# Altium schematic sheet [03] PWM DRIVER.SchDoc
size A
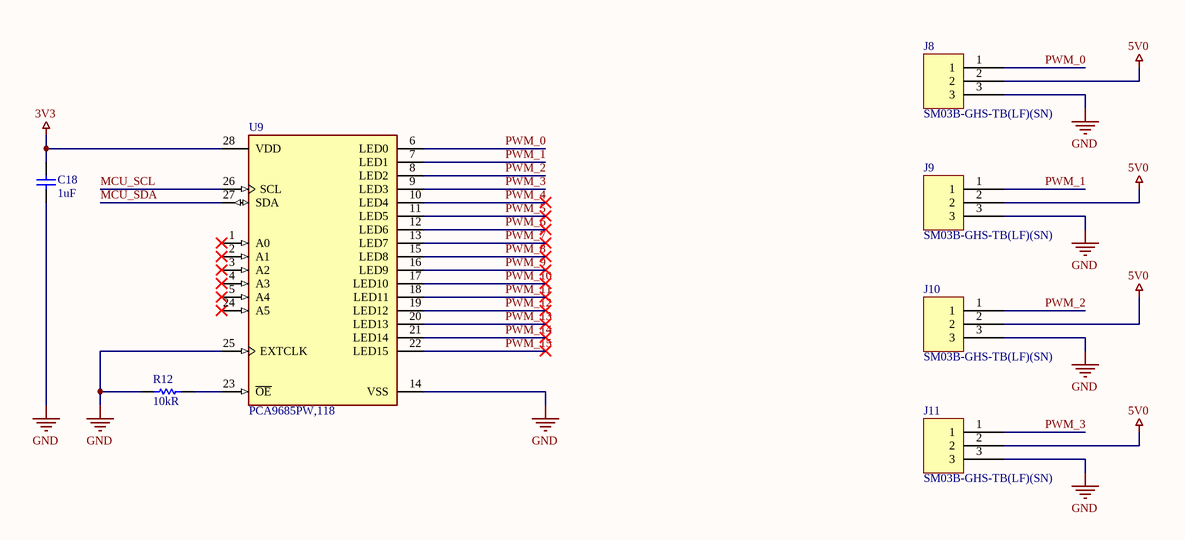
[diagram p0: [03] PWM DRIVER.SchDoc]

## Parts
C18  1uF  [INCH 0805 - METRIC 2012 - H140]
J8  SM03B-GHS-TB(LF)(SN)  [SM03B-GHS-TB(LF)(SN)]
J9  SM03B-GHS-TB(LF)(SN)  [SM03B-GHS-TB(LF)(SN)]
J10  SM03B-GHS-TB(LF)(SN)  [SM03B-GHS-TB(LF)(SN)]
J11  SM03B-GHS-TB(LF)(SN)  [SM03B-GHS-TB(LF)(SN)]
R12  10kR  [INCH 0805 - METRIC 2012 - H070]
U9  PCA9685PW,118  [FP-SOT361-1-MFG]

## Nets
3V3: C18.2 U9.28(VDD)
5V0: J8.2 J9.2 J10.2 J11.2
GND: C18.1 J8.3 J9.3 J10.3 J11.3 R12.2 U9.14(VSS) U9.25(EXTCLK)
MCU_SCL: U9.26(SCL)
MCU_SDA: U9.27(SDA)
PWM_0: J8.1 U9.6(LED0)
PWM_1: J9.1 U9.7(LED1)
PWM_2: J10.1 U9.8(LED2)
PWM_3: J11.1 U9.9(LED3)
PWM_4: U9.10(LED4)
PWM_5: U9.11(LED5)
PWM_6: U9.12(LED6)
PWM_7: U9.13(LED7)
PWM_8: U9.15(LED8)
PWM_9: U9.16(LED9)
PWM_10: U9.17(LED10)
PWM_11: U9.18(LED11)
PWM_12: U9.19(LED12)
PWM_13: U9.20(LED13)
PWM_14: U9.21(LED14)
PWM_15: U9.22(LED15)
NetR12_1: R12.1 U9.23(~{OE})

Not connected (* = marked no-connect by the designer): U9 1(A0)* 2(A1)* 3(A2)* 4(A3)* 5(A4)* 24(A5)*

## Library data of the parts
C18 = GCM21BR71E105KA56L: CAP SMD 1uF 25V 10% 0805; Manufacturer: Murata; Dielectric: X7R; Supplier 1: Digi-Key; Manufacturer Part Number: GCM21BR71E105KA56L; RoHS: Yes; Category: Ceramic Capacitors; Stock 1: 1572955; Pricing 1: 1=0.33000, 10=0.22500, 100=0.12760, 500=0.09004, 1000=0.07878 (USD); Mount: Surface Mount; Case/Package: 0805; Case Code (Metric): 2012; Case Code (Imperial): 0805; Min Operating Temperature: -55°C; Max Operating Temperature: 125°C; Termination: SMD/SMT; Voltage: 25V; Package Quantity: 3000; Capacitance: 1uF; Voltage Rating: 25V; Tolerance: 10%; Packaging: Tape and Reel; Voltage Rating (DC): 25V; Length: 2mm; Height: 1.25mm; Thickness: 0.055inch; Depth: 1.25mm; Width: 0.049inch; Ratings: AEC-Q200; Radiation Hardening: No; REACH SVHC: No SVHC; Lead Free: Lead Free; ComponentLink1URL: https://datasheet.ciiva.com/3778/359gcm21br71e105ka5623-3778560.pdf?src-supplier=Arrow; ComponentLink1Description: https://datasheet.ciiva.com/3778/359gcm21br71e105ka5623-3778560.pdf?src-supplier=Arrow; ComponentLink2URL: https://datasheet.ciiva.com/16624/product-16624576.pdf?src-supplier=Avnet+Europe; ComponentLink2Description: https://datasheet.ciiva.com/16624/product-16624576.pdf?src-supplier=Avnet+Europe; ComponentLink3URL: https://datasheet.ciiva.com/18183/getdatasheetpartid-153106-18183696.pdf?src-supplier=Verical; ComponentLink3Description: https://datasheet.ciiva.com/18183/getdatasheetpartid-153106-18183696.pdf?src-supplier=Verical; ComponentLink4URL: https://datasheet.ciiva.com/11789/0900766b80ef92d0-11789092.pdf?src-supplier=RSComponents; ComponentLink4Description: https://datasheet.ciiva.com/11789/0900766b80ef92d0-11789092.pdf?src-supplier=RSComponents; ComponentLink5URL: https://datasheet.ciiva.com/137/product-137199.pdf?src-supplier=Digi-Key; ComponentLink5Description: https://datasheet.ciiva.com/137/product-137199.pdf?src-supplier=Digi-Key; ComponentLink6URL: https://datasheet.ciiva.com/137/product-137200.pdf?src-supplier=Digi-Key; ComponentLink6Description: https://datasheet.ciiva.com/137/product-137200.pdf?src-supplier=Digi-Key; ComponentLink7URL: https://datasheet.ciiva.com/137/product-137201.pdf?src-supplier=Digi-Key; ComponentLink7Description: https://datasheet.ciiva.com/137/product-137201.pdf?src-supplier=Digi-Key; ComponentLink8URL: https://datasheet.ciiva.com/2989/product-2989245.pdf?src-supplier=Avnet; ComponentLink8Description: https://datasheet.ciiva.com/2989/product-2989245.pdf?src-supplier=Avnet; ComponentLink9URL: https://datasheet.ciiva.com/2989/product-2989246.pdf?src-supplier=Avnet; ComponentLink9Description: https://datasheet.ciiva.com/2989/product-2989246.pdf?src-supplier=Avnet; Supplier Part Number 1: 490-4785-1-ND
J8-J11 = SM03B-GHS-TB(LF)(SN): JST (JAPAN SOLDERLESS TERMINALS) - SM03B-GHS-TB (LF)(SN) - MACHO, 1,25 MM, 3 VÍAS, SMT, 90 GRADOS; Current Rating: 1A; Voltage Rating (AC): 50V; Gender: Male; Connector Type: Outer Shroud Contact; Number of Positions: 3; Wire/Cable Gauge: 26AWG; Pitch: 0.049inch; Supplier 1: Digi-Key; Manufacturer: JST; Manufacturer Part Number: SM03B-GHS-TB(LF)(SN); RoHS: Yes; Category: Headers and Wire Housings; Stock 1: 8954; Pricing 1: 1=0.49000, 10=0.46500, 100=0.32580, 500=0.27924, 1000=0.23270 (USD); Mount: Surface Mount; Contact Plating: Tin; Contact Material: Bronze; Housing Material: Nylon; Color: Natural; Housing Color: Natural; Min Operating Temperature: -25°C; Max Operating Temperature: 85°C; Number of Rows: 1; Voltage Rating: 50V; Orientation: Right Angle; Packaging: Tape and Reel; Termination: Solder; Fastening Type: Ramp; Number of Contacts: 3; REACH SVHC: No SVHC; Lead Free: Lead Free; ComponentLink1URL: https://datasheet.ciiva.com/25617/0900766b810cef18-25617270.pdf?src-supplier=RSComponents; ComponentLink1Description: https://datasheet.ciiva.com/25617/0900766b810cef18-25617270.pdf?src-supplier=RSComponents; ComponentLink2URL: https://datasheet.ciiva.com/16379/jstsm03b-ghs-tb-lf-sn-16379590.pdf?src-supplier=Future+Electronics; ComponentLink2Description: https://datasheet.ciiva.com/16379/jstsm03b-ghs-tb-lf-sn-16379590.pdf?src-supplier=Future+Electronics; ComponentLink3URL: https://datasheet.ciiva.com/8052/5438-8052261.pdf?src-supplier=Element14; ComponentLink3Description: https://datasheet.ciiva.com/8052/5438-8052261.pdf?src-supplier=Element14; Supplier Part Number 1: 455-1565-1-ND
R12 = ERJ-P06F1002V: RES SMD 10kOHM 1% 1/2W 0805; Manufacturer: Panasonic; Power Rating: 500mW; Voltage Rating: 150V; Temperature Coefficient: 100ppm/°C; Supplier 1: Digi-Key; Manufacturer Part Number: ERJ-P06F1002V; RoHS: Yes; Category: Chip SMD Resistors; Stock 1: 119213; Pricing 1: 1=0.17000, 10=0.14800, 100=0.05770, 1000=0.02416, 2500=0.02214 (USD); Mount: Surface Mount; Case/Package: 0805; Case Code (Imperial): 0805; Case Code (Metric): 2012; Contact Plating: Tin; Min Operating Temperature: -55°C; Max Operating Temperature: 155°C; Resistance: 10kR; Packaging: Tape and Reel; Tolerance: 1%; Package Quantity: 5000; Termination: SMD/SMT; Military Standard: Not; Voltage Rating (DC): 150V; Composition: Thick Film; Length: 2mm; Height: 0.6mm; Width: 1.2mm; Depth: 1.25mm; Radiation Hardening: No; REACH SVHC: No SVHC; Lead Free: Lead Free; ComponentLink1URL: https://datasheet.ciiva.com/11811/0900766b812cb812-11811124.pdf?src-supplier=RSComponents; ComponentLink1Description: https://datasheet.ciiva.com/11811/0900766b812cb812-11811124.pdf?src-supplier=RSComponents; ComponentLink2URL: https://datasheet.ciiva.com/24069/aoa0000ce4-64075-24069191.pdf?src-supplier=Mouser; ComponentLink2Description: https://datasheet.ciiva.com/24069/aoa0000ce4-64075-24069191.pdf?src-supplier=Mouser; ComponentLink3URL: https://datasheet.ciiva.com/48426/erjp-series-eng-tds-48426779.pdf?src-supplier=Distrelec; ComponentLink3Description: https://datasheet.ciiva.com/48426/erjp-series-eng-tds-48426779.pdf?src-supplier=Distrelec; Supplier Part Number 1: P16059CT-ND
U9 = CMP-10140-000001-1: IC LED DRIVER RGBA 28-TSSOP; Manufacturer: NXP Semiconductors; Max Power Dissipation: 400mW; Dimming: I2C,PWM; Number Of Outputs: 16; Import Ts: 1521846855; Min Supply Voltage: 2.3V; Max Supply Voltage: 5.5V; Output Voltage: 5V; Nominal Supply Current: 6mA; Standoff Height: 0.05mm; Output Current: 25mA; Ciiva Ids: 1426473; Temperature Range Low: -40°C; Footprint Url: https://www.nxp.com/docs/en/package-information/SOT361-1.pdf; Height: 1.1mm; Manufacturer Part Number: PCA9685PW,118; Device Class L2: Power Management ICs; Temperature: -40°C to +85°C; Temperature Range High: +85°C; Digikey Description: IC LED DRIVER RGBA 28-TSSOP; ComponentLink2Description: Datasheet; Device Class L3: LED Drivers; Ambient Temperature Range Low: -40°C; ComponentLink2URL: https://www.nxp.com/docs/en/data-sheet/PCA9685.pdf; Ambient Temperature Range High: +85°C; Device Class L1: Integrated Circuits (ICs); Mouser Description: LED Display Drivers I2C Bus LED Controller 28-Pin; Octopart: https://octopart.com/pca9685pw%2C118-nxp+semiconductors-11853435; Release Date: 1454319143; Lead Free: Yes; Category: IC; RoHS: TRUE; Package: SOT361-1; Automotive: No